# EAGLE design alimentation (EAGLE 5.12)
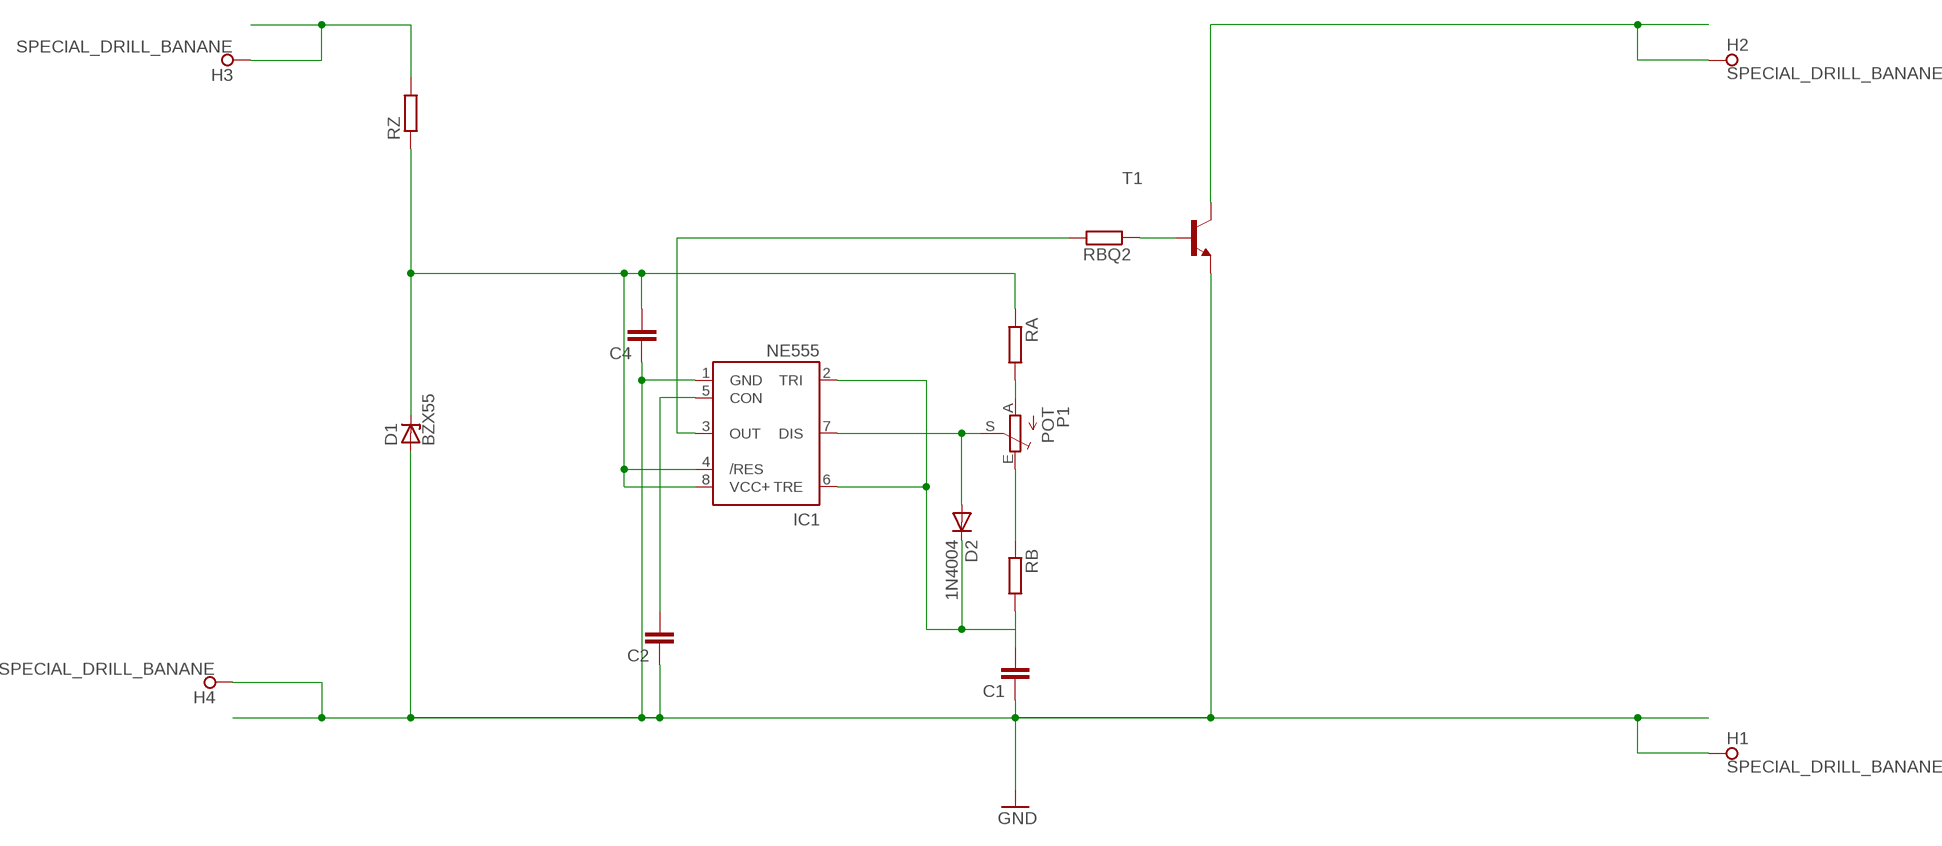
[diagram p0: schematic, sheet 1]

## Parts
C1  C-EU102-043X133  [C102-043X133]
C2  C-EU050-025X075  [C050-025X075]
C4  C-EU050-025X075  [C050-025X075]
D1  BZX55  [DO35Z10]
D2  1N4004  [DO41-10]
H1  SPECIAL_DRILL_BANANE  [PAD_0.2500]
H2  SPECIAL_DRILL_BANANE  [PAD_0.2500]
H3  SPECIAL_DRILL_BANANE  [PAD_0.2500]
H4  SPECIAL_DRILL_BANANE  [PAD_0.2500]
IC1  NE555  [DIL-08]
P1  POT  TRIM_EU-LI10  [LI10]
RA  R-EU_0207/10  [0207/10]
RB  R-EU_0207/10  [0207/10]
RBQ2  R-EU_0207/10  [0207/10]
RZ  R-EU_0207/10  [0207/10]
T1  2N4124-NPN-TO92-CBE  [TO92-CBE]

## Nets
GND: C1.1 C2.1 C4.1 D1.A H1.1 H4.1 IC1.1(GND) T1.E
N$1: C2.2 IC1.5(CON)
N$2: H2.1 T1.C
N$4: P1.A RA.2
N$6: D2.A IC1.7(DIS) P1.S
N$7: P1.E RB.1
N$8: IC1.3(OUT) RBQ2.2
N$9: C4.2 D1.C IC1.4(/RES) IC1.8(VCC+) RA.1 RZ.1
N$10: C1.2 D2.C IC1.2(TRI) IC1.6(TRE) RB.2
N$11: RBQ2.1 T1.B
N$14: H3.1 RZ.2

## Library data of the parts
C1 C2 C4 = rcl:C-EU: CAPACITOR, European symbol
D1 = diode:BZX55: Z DIODE
D2 = diode:1N4004: DIODE general purpose rectifier, 1 A
H1-H4 = special-drill:SPECIAL_DRILL_: Special drills
IC1 = st-microelectronics:NE555: General purpose bipolar Timer; MF: Arrow Electronics; MPN: NE555N; OC_FARNELL: 1467742; OC_NEWARK: 89K1486
P1 = pot:TRIM_EU-: POTENTIOMETER
RA RB RBQ2 RZ = resistor:R-EU_: RESISTOR, European symbol
T1 = transistor:*-NPN-: NPN Transistror BF959 corrected 2008.03.06

## Board
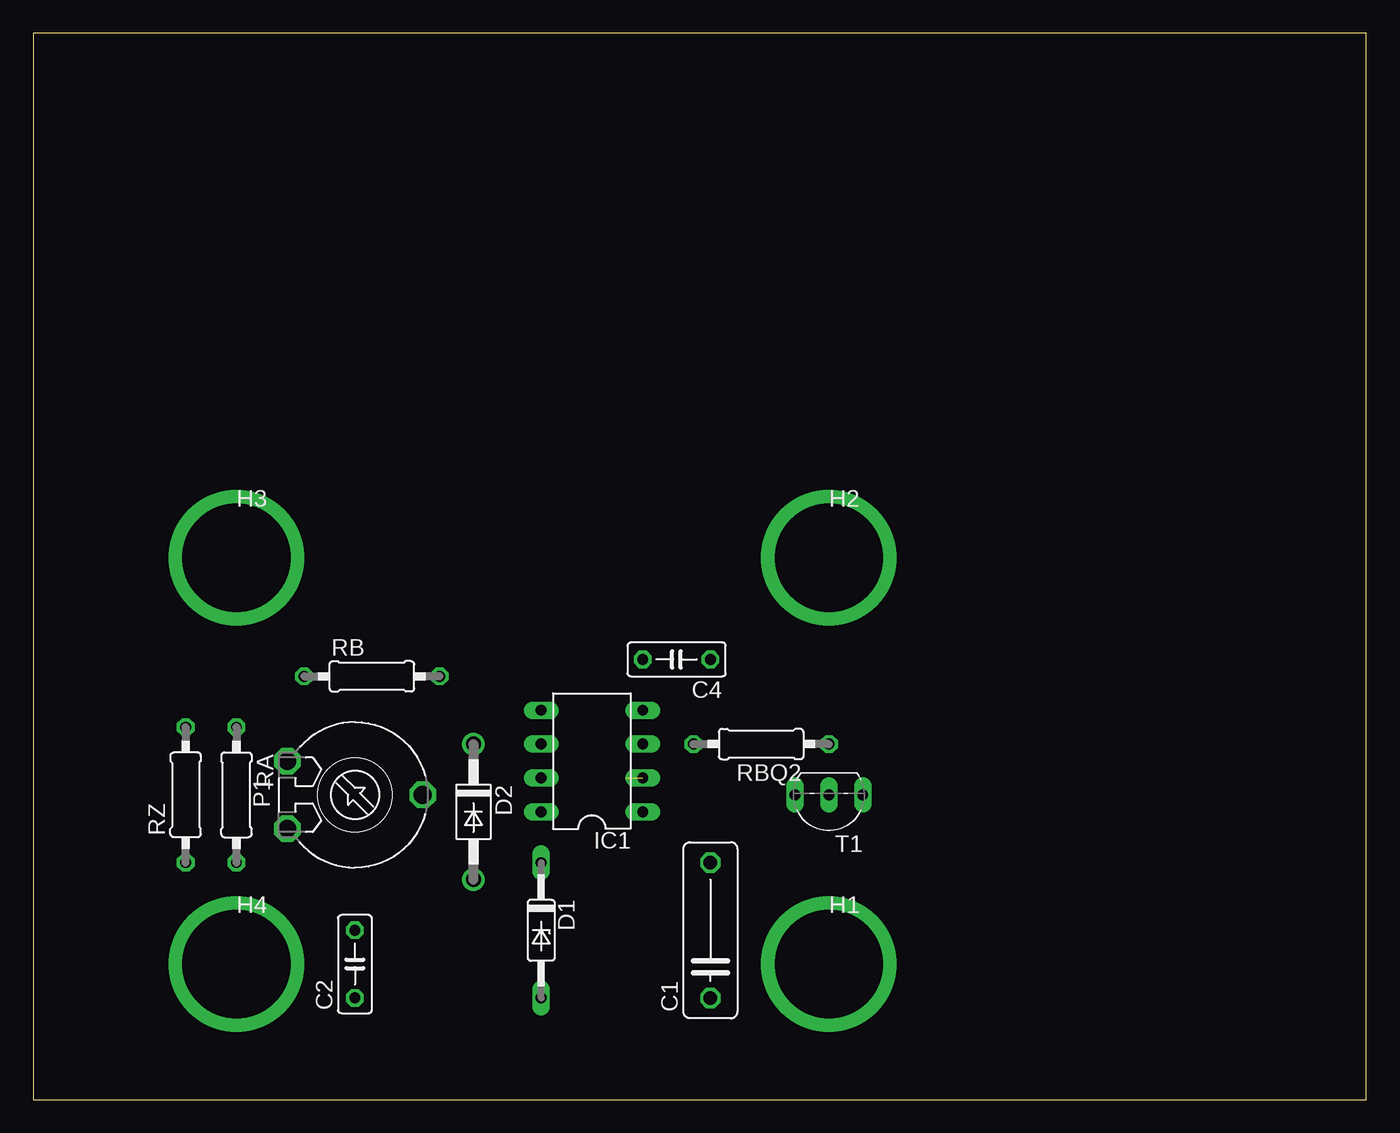
[diagram p1: board, top side]
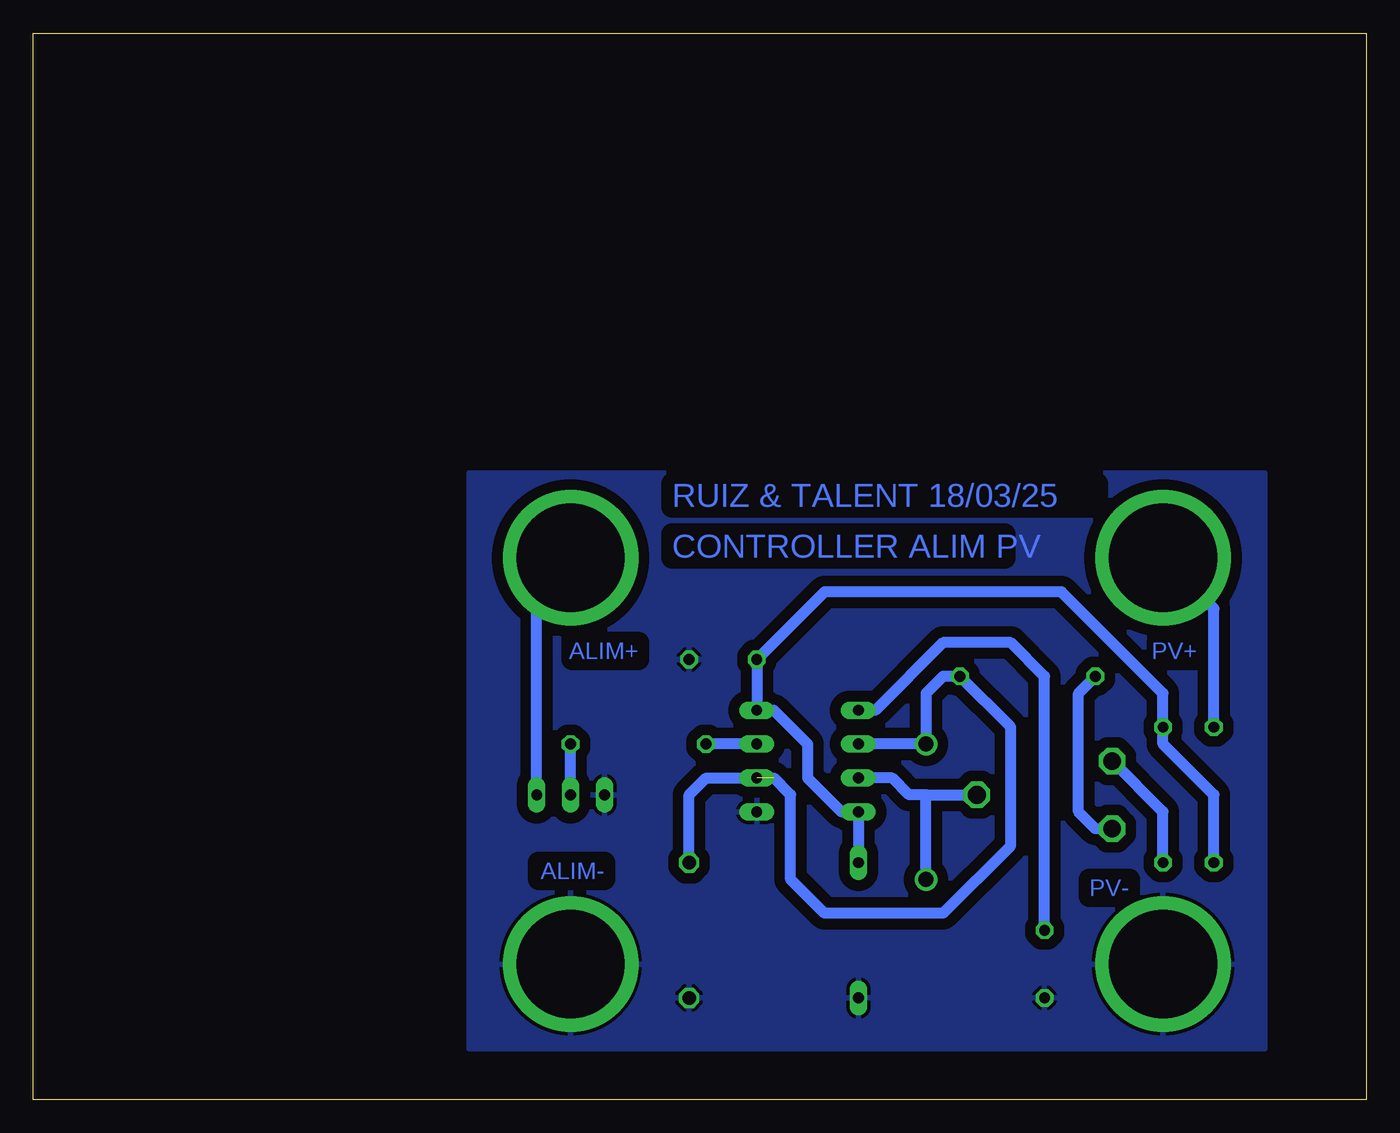
[diagram p2: board, bottom side, seen from below]

Size 100 x 80 mm. Coordinates in mm from the lower left corner, seen from the top.
Outline: 0,0 100,0 100,80 0,80 0,0
Copper layers (1*16): Top 0.035mm / dielectric 1.5mm / Bottom 0.035mm
Design rules "default *": minimum track width 10mil, minimum drill 24mil, track to track 8mil, track to pad 8mil, pad to pad 8mil, via to via 8mil, smd to smd 8mil, copper to edge 40mil, drill to drill 8mil, minimum pad ring 10mil, minimum via ring 8mil, stop-mask expansion 4mil, vias tented up to drill 0mil, thermal gap 10mil

### Footprints (pad centres in the part's own frame; a part is rotated, then mirrored left to right if it is on the bottom)
C102-043X133 = drill 1.016 octagon: 1 -5.08,0; 2 5.08,0
C050-025X075 = drill 0.813 octagon: 1 -2.54,0; 2 2.54,0
DO35Z10 = drill 0.813 long: A 5.08,0; C -5.08,0
DO41-10 = drill 1.118 round: A 5.08,0; C -5.08,0
PAD_0.2500 = drill 8.128 pad 10.16 round: 1 0,0
DIL-08 = drill 0.813 long: 1 -3.81,-3.81; 2 -1.27,-3.81; 3 1.27,-3.81; 4 3.81,-3.81; 5 3.81,3.81; 6 1.27,3.81; 7 -1.27,3.81; 8 -3.81,3.81
LI10 = drill 1.321 octagon: A -2.54,-5.08; E 2.54,-5.08; S 0,5.08
0207/10 = drill 0.813 octagon: 1 -5.08,0; 2 5.08,0
TO92-CBE = drill 0.813 long: B 0,0; C -2.54,0; E 2.54,0

### Placement (x,y rotation side)
C1  50.8,12.7 90 top
C2  24.13,10.16 90 top
C4  48.26,33.02 180 top
D1  38.1,12.7 270 top
D2  33.02,21.59 270 top
H1  59.69,10.16 0 top
H2  59.69,40.64 0 top
H3  15.24,40.64 0 top
H4  15.24,10.16 0 top
IC1  41.91,25.4 90 top
P1  24.13,22.86 270 top
RA  15.24,22.86 270 top
RB  25.4,31.75 0 top
RBQ2  54.61,26.67 180 top
RZ  11.43,22.86 90 top
T1  59.69,22.86 180 top

### Tracks (layer width: path | path; a pad name or v marks a point on that pad's centre or on a via)
GND
  pour Bottom (isolate 0.813): 7.62,46.99 67.31,46.99 67.31,3.81 7.62,3.81
N$1
  Bottom 0.813: IC1.5 36.83,29.21 31.75,34.29 26.67,34.29 24.13,31.75 C2.2
N$2
  Bottom 0.813: T1.C 62.23,38.1 H2.1
N$4
  Bottom 0.813: RA.2 15.24,21.59 P1.A
N$6
  Bottom 0.813: 33.02,22.86 P1.S | 33.02,22.86 34.29,22.86 35.56,24.13 IC1.7 | D2.A 33.02,22.86
N$7
  Bottom 0.813: P1.E 20.32,20.32 21.59,21.59 21.59,30.48 RB.1
N$8
  Bottom 0.813: IC1.3 RBQ2.2
N$9
  Bottom 0.813: D1.C IC1.8 39.37,21.59 41.91,24.13 41.91,26.67 44.45,29.21 IC1.4 C4.2 40.64,38.1 22.86,38.1 15.24,30.48 RA.1 15.24,26.67 11.43,22.86 RZ.1
N$10  (1 unrouted)
  Bottom 0.813: 44.45,24.13 43.18,22.86 43.18,16.51 40.64,13.97 31.75,13.97 26.67,19.05 26.67,27.94 RB.2 31.75,31.75 33.02,30.48 D2.C IC1.6 | C1.2 50.8,22.86 49.53,24.13 IC1.2
N$11
  Bottom 0.813: T1.B RBQ2.1
N$14
  Bottom 0.813: H3.1 11.43,36.83 RZ.2

### Text on the board
Bottom: RUIZ & TALENT 18/03/25 | CONTROLLER ALIM PV | PV+ | ALIM+ | ALIM- | PV-